# Altium schematic sheet sim7600CE.SchDoc
size A3; SheetNumber: 1; SheetTotal: 1
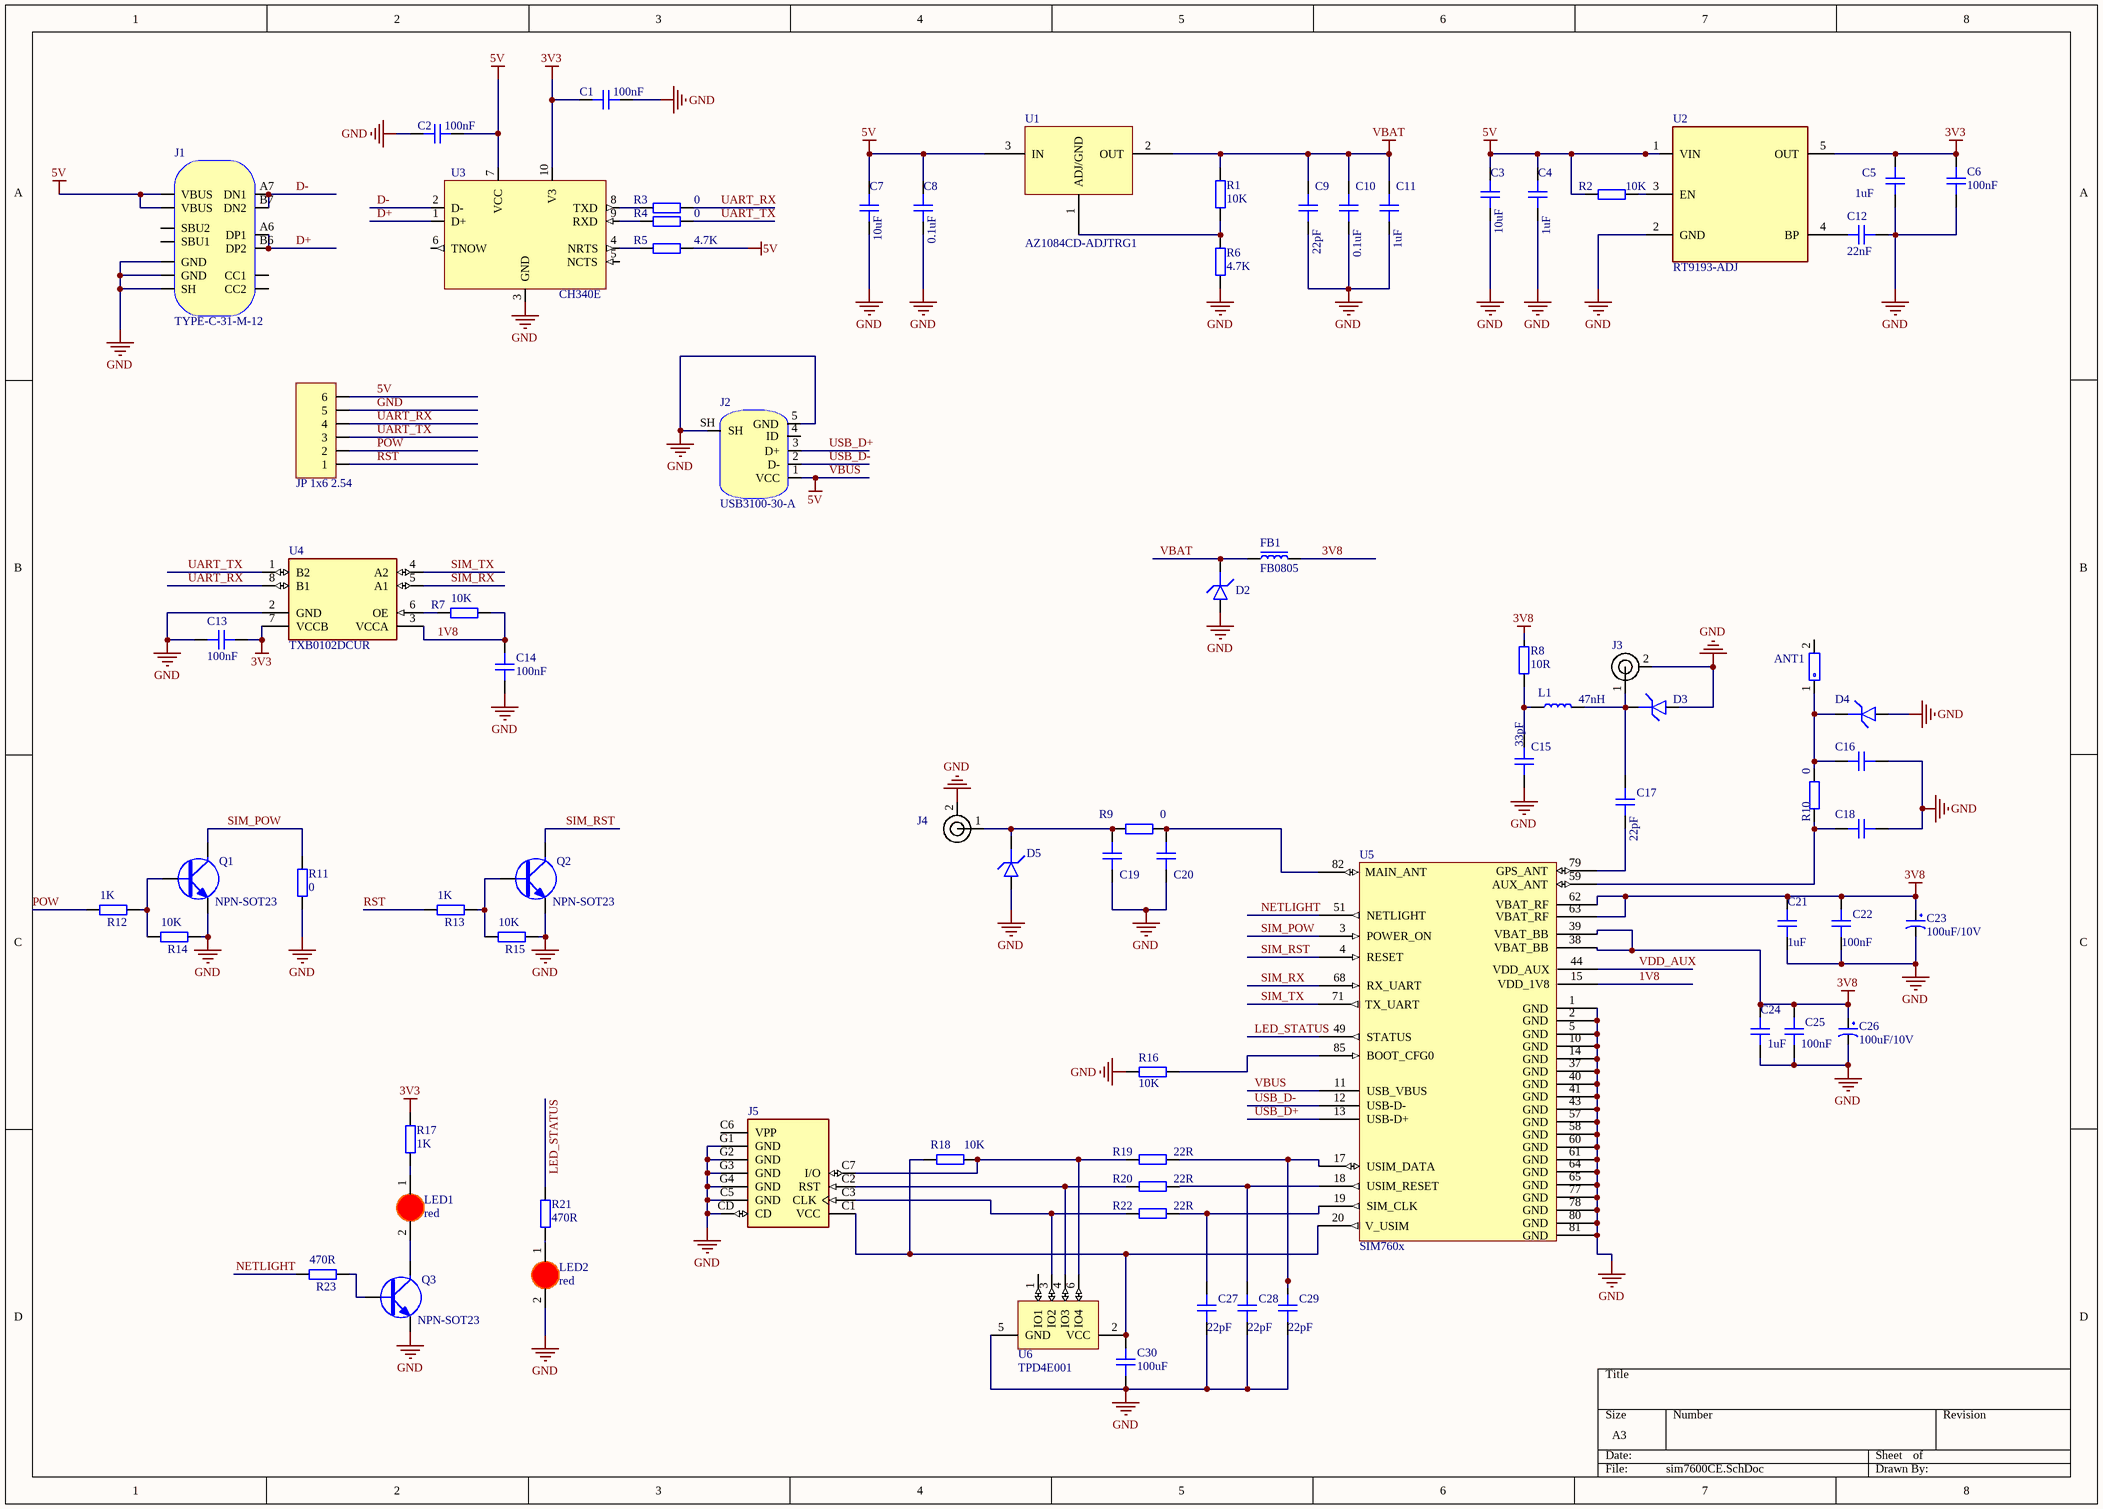
[diagram p0: sim7600CE.SchDoc]

## Parts
ANT1  ANT MAIN  [AMCA92-2R660G-S1F-T]  (value not drawn)
C1  100nF  [CAP_0603]
C2  100nF  [CAP_0603]
C3  10uF  [CAP_0603]
C4  1uF  [CAP_0603]
C5  1uF  [CAP_0603]
C6  100nF  [CAP_0603]
C7  10uF  [CAP_0603]
C8  0.1uF  [CAP_0603]
C9  22pF  [CAP_0603]
C10  0.1uF  [CAP_0603]
C11  1uF  [CAP_0603]
C12  22nF  [CAP_0603]
C13  100nF  [CAP_0603]
C14  100nF  [CAP_0603]
C15  33pF  [CAP_0603]
C16  C0603  [CAP_0603]  (value not drawn)
C17  22pF  [CAP_0603]
C18  C0603  [CAP_0603]  (value not drawn)
C19  C0603  [CAP_0603]  (value not drawn)
C20  C0603  [CAP_0603]  (value not drawn)
C21  1uF  [CAP_0603]
C22  100nF  [CAP_0603]
C23  100uF/10V  [tu tantalum smd3216]
C24  1uF  [CAP_0603]
C25  100nF  [CAP_0603]
C26  100uF/10V  [tu tantalum smd3216]
C27  22pF  [CAP_0603]
C28  22pF  [CAP_0603]
C29  22pF  [CAP_0603]
C30  100uF  [CAP_0603]
D2  D_TVS_0402  [D_0402]  (value not drawn)
D3  D_TVS_0402  [D_0402]  (value not drawn)
D4  D_TVS_0402  [D_0402]  (value not drawn)
D5  D_TVS_0402  [D_0402]  (value not drawn)
FB1  FB0805  [FB_0805]
J1  TYPE-C-31-M-12  [TYPE-C-31-M-12]
J2  USB3100-30-A  [USB3100-30-A]
J3  U.FL-R-SMT-1(60)  [U.FL-R-SMT-1(60)]  (value not drawn)
J4  U.FL-R-SMT-1(60)  [U.FL-R-SMT-1(60)]  (value not drawn)
J5  SIM8066-6-1-14-01-A_REVA  [GCT_SIM8066-6-1-14-01-A_REVA]  (value not drawn)
JP1  JP 1x6 2.54  [HDR1X6]
L1  47nH  [IND_0603]
LED1  red  [LED-0805-Red]
LED2  red  [LED-0805-Red]
Q1  NPN-SOT23  [SOT23 - 3PIN]
Q2  NPN-SOT23  [SOT23 - 3PIN]
Q3  NPN-SOT23  [SOT23 - 3PIN]
R1  10K  [RES_0603]
R2  10K  [RES_0603]
R3  0  [RES_0603]
R4  0  [RES_0603]
R5  4.7K  [RES_0603]
R6  4.7K  [RES_0603]
R7  10K  [RES_0603]
R8  10R  [RES_0603]
R9  0  [RES_0603]
R10  0  [RES_0603]
R11  0  [RES_0603]
R12  1K  [RES_0603]
R13  1K  [RES_0603]
R14  10K  [RES_0603]
R15  10K  [RES_0603]
R16  10K  [RES_0603]
R17  1K  [RES_0603]
R18  10K  [RES_0603]
R19  22R  [RES_0603]
R20  22R  [RES_0603]
R21  470R  [RES_0603]
R22  22R  [RES_0603]
R23  470R  [RES_0603]
U1  AZ1084CD-ADJTRG1  [TO252 DPAK]
U2  RT9193-ADJ  [SOT-23-5]
U3  CH340E  [MSOP-10]
U4  TXB0102DCUR  [txb0102]
U5  SIM760x  [SIM7600CE - duplicate]
U6  TPD4E001  [TSOT-26-6]

## Nets
3V3: C1.1 C5.1 C6.1 C13.2 R17.2 U2.5(OUT) U3.10(V3) U4.7(VCCB)
3V8: C21.1 C22.1 C23.1 C24.1 C25.1 C26.1 FB1.2 R8.2 U5.38(VBAT_BB) U5.39(VBAT_BB) U5.62(VBAT_RF) U5.63(VBAT_RF)
5V: C2.2 C3.1 C4.1 C7.1 C8.1 J1.A4B9(VBUS) J1.B4A9(VBUS) J2.1(VCC) JP1.6 R2.1 R5.2 U1.3(IN) U2.1(VIN) U3.7(VCC) U5.11(USB_VBUS)  [also labelled VBUS]
GND: C1.2 C2.1 C3.2 C4.2 C5.2 C6.2 C7.2 C8.2 C9.2 C10.2 C11.2 C12.2 C13.1 C14.2 C15.2 C16.1 C18.1 C19.1 C20.1 C21.2 C22.2 C23.2 C24.2 C25.2 C26.2 C27.1 C28.1 C29.1 C30.1 D2.A D3.A D4.A D5.A J1.A1B12(GND) J1.B1A12(GND) J1.SH J2.5(GND) J2.SH J3.2 J4.2 J5.C5(GND) J5.CD J5.G1(GND) J5.G2(GND) J5.G3(GND) J5.G4(GND) JP1.5 LED2.2(K) Q1.2(E) Q2.2(E) Q3.2(E) R6.1 R11.1 R14.2 R15.2 R16.1 U2.2(GND) U3.3(GND) U4.2(GND) U5.1(GND) U5.2(GND) U5.5(GND) U5.10(GND) U5.14(GND) U5.37(GND) U5.40(GND) U5.41(GND) U5.43(GND) U5.57(GND) U5.58(GND) U5.60(GND) U5.61(GND) U5.64(GND) U5.65(GND) U5.77(GND) U5.78(GND) U5.80(GND) U5.81(GND) U6.5(GND)
VBAT: C9.1 C10.1 C11.1 D2.K FB1.1 R1.2 U1.2(OUT)
1V8: C14.1 R7.2 U4.3(VCCA) U5.15(VDD_1V8)
D+: J1.A6(DP1) J1.B6(DP2) U3.1(D+)
D-: J1.A7(DN1) J1.B7(DN2) U3.2(D-)
LED_STATUS: R21.1 U5.49(STATUS)
NETLIGHT: R23.1 U5.51(NETLIGHT)
POW: JP1.2 R12.1
RST: JP1.1 R13.1
SIM_POW: Q1.3(C) R11.2 U5.3(POWER_ON)
SIM_RST: Q2.3(C) U5.4(RESET)
SIM_RX: U4.5(A1) U5.68(RX_UART)
SIM_TX: U4.4(A2) U5.71(TX_UART)
UART_RX: JP1.4 R3.2 U4.8(B1)
UART_TX: JP1.3 R4.2 U4.1(B2)
USB_D+: J2.3(D+) U5.13(USB-D+)
USB_D-: J2.2(D-) U5.12(USB-D-)
VDD_AUX: U5.44(VDD_AUX)
NetANT1_1: ANT1.1 C16.2 D4.K R10.1
NetC12_1: C12.1 U2.4(BP)
NetC15_1: C15.1 L1.1 R8.1
NetC17_1: C17.1 U5.79(GPS_ANT)
NetC17_2: C17.2 D3.K J3.1 L1.2
NetC18_2: C18.2 R10.2 U5.59(AUX_ANT)
NetC19_2: C19.2 D5.K J4.1 R9.2
NetC20_2: C20.2 R9.1 U5.82(MAIN_ANT)
NetC27_2: C27.2 R22.2 U5.19(SIM_CLK)
NetC28_2: C28.2 R20.2 U5.18(USIM_RESET)
NetC29_2: C29.2 R19.2 U5.17(USIM_DATA)
NetC30_2: C30.2 J5.C1(VCC) R18.1 U5.20(V_USIM) U6.2(VCC)
NetJ5_C2: J5.C2(RST) R20.1 U6.4(IO3)
NetJ5_C3: J5.C3(CLK) R22.1 U6.3(IO2)
NetJ5_C7: J5.C7(I/O) R18.2 R19.1 U6.6(IO4)
NetLED1_1: LED1.1(A) R17.1
NetLED1_2: LED1.2(K) Q3.3(C)
NetLED2_1: LED2.1(A) R21.2
NetQ1_1: Q1.1(B) R12.2 R14.1
NetQ2_1: Q2.1(B) R13.2 R15.1
NetQ3_1: Q3.1(B) R23.2
NetR1_1: R1.1 R6.2 U1.1(ADJ/GND)
NetR2_2: R2.2 U2.3(EN)
NetR3_1: R3.1 U3.8(TXD)
NetR4_1: R4.1 U3.9(RXD)
NetR5_1: R5.1 U3.4(NRTS)
NetR7_1: R7.1 U4.6(OE)
NetR16_2: R16.2 U5.85(BOOT_CFG0)

Not connected (* = marked no-connect by the designer): ANT1 2; J1 A5(CC1) A8(SBU1) B5(CC2) B8(SBU2); J2 4(ID); J5 C6(VPP); U3 5(NCTS) 6(TNOW); U6 1(IO1)

## Library data of the parts
ANT1 = AMCA92-2R660G-S1F-T
C1-C22 C24 C25 C27-C30 = CAP_0603: Capacitor SMD 0603; Manufacturer: *; Manufacturer Part Number: *; Distributor Link: *; LCSC: *; Rating: *; Dielectric: *
C23 C26 = CAP 477C: Tụ tantalum 7343 477C 16V 470uF 7.3x4.3mm
D2-D5 = D_TVS_0402: Diode TVS / ESD 0402
FB1 = FB_0805: Ferrite Bead SMD 0805; Manufacturer: *; Manufacturer Part Number: *; Distributor Link: *; LCSC: *
J1 = TYPE-C-31-M-12: USB Type C Connector Horizontal SMT; Manufacturer: Koren Hroparts; Manufacturer Part Number: TYPE-C-31-M-12
J2 = USB3100-30-A: USB Connector Type Micro B 2.0 SMD Reverse Mount; Manufacturer: GCT; Manufacturer Part Number: USB3100-30-A
J3 J4 = ANT-SMD: RF Connector u.FL 50 Ohms 6 GHz; Manufacturer: Hirose Connector; Manufacturer Part Number: U.FL-R-SMT-1(60)
J5 = SIM8066-6-1-14-01-A_REVA: Nano SIM Card ConnectorPush-Push Type, SMT, 6Pin, 1.44mm Profile; Package: None; Price: None; Value: *; MP: SIM8066-6-1-14-01-A_REVA; Availability: Unavailable
JP1 = JP 1x6 2.54 Duc Thang: Cắm; Ten_Linh_Kien: Jump Đơn Đực 2.54MM 1x40P Thẳng 11MM; Don_Vi: Con; Ma_Hang: MH000903; Ghi_Chu: *; Kieu_Chan: *; Chung_Loai: Cắm
L1 = IND_0603: Inductor SMD 0603
LED1 LED2 = LED_0805_RED
R1-R23 = RES_0603: Resistor SMD 0603; Manufacturer: *; Manufacturer Part Number: *; Distributor Link: *; LCSC: *
U1 = AZ1084CD-ADJTRG1: Linear Voltage Regulator IC Positive Adjustable 1 Output 5A TO-252-3
U2 = RT9193: Linear Voltage Regulator IC Positive Fixed 1 Output 300mA SOT-23-5
U3 = CH340E: USB-to-UART Transceiver MSOP-10; Manufacturer Part Number: CH340E
U4 = TXB0102DCUR: 2-Bit Bidirectional Voltage-Level Shifter with Auto Direction Sensing and +/-15-kV ESD Protect 8-VSSOP -40 to 85; MF: Texas Instruments; Digi-Key_Part_Number: 296-22862-1-ND; MP: TXB0102DCUR; Value: *; SnapEDA_Link: https://www.snapeda.com/parts/TXB0102DCUR/Texas%20Instruments/view-part/350005/?ref=snap; DigiKey-Purchase-URL: https://snapeda.com/shop?store=DigiKey&id=350005; Package: VSSOP-8 Texas Instruments; Texas_Instruments-Purchase-URL: https://snapeda.com/shop?store=Texas+Instruments&id=350005; Mouser-Purchase-URL: https://snapeda.com/shop?store=Mouser&id=350005